# EAGLE design tlacitka (EAGLE 4.11)
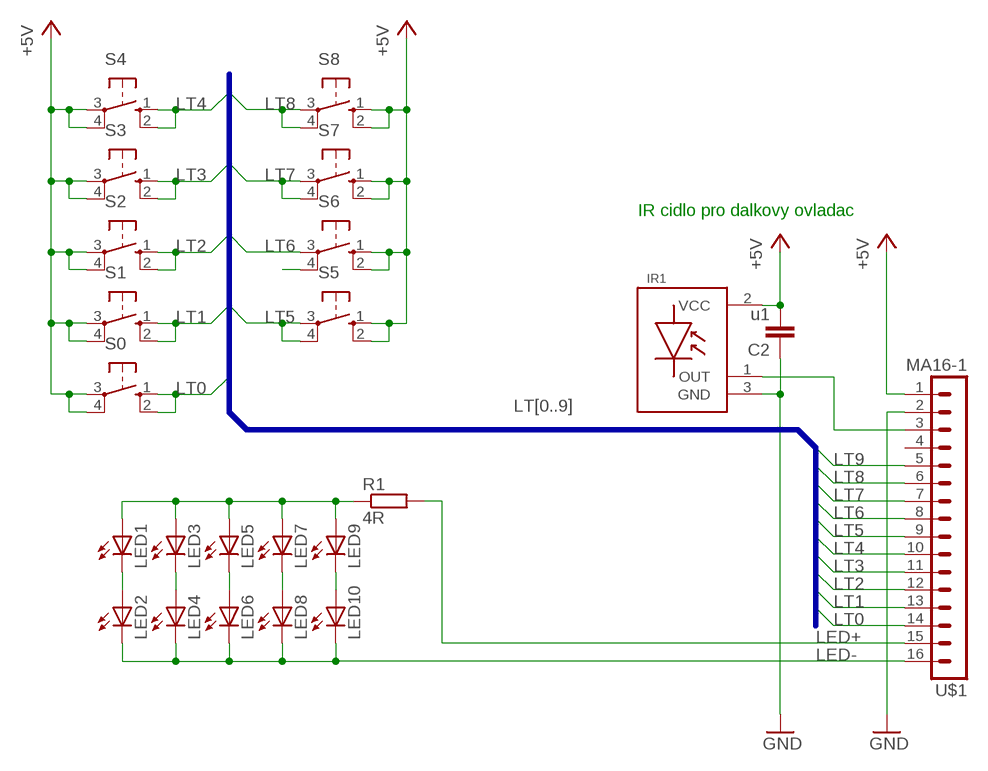
[diagram p0: schematic, sheet 1]

## Parts
C2  u1  C-EUC1206  [C1206]
IR1  SFH506-56  [SFH506]
LED1  LEDCHIPLED_1206  [CHIPLED_1206]
LED2  LEDCHIPLED_1206  [CHIPLED_1206]
LED3  LEDCHIPLED_1206  [CHIPLED_1206]
LED4  LEDCHIPLED_1206  [CHIPLED_1206]
LED5  LEDCHIPLED_1206  [CHIPLED_1206]
LED6  LEDCHIPLED_1206  [CHIPLED_1206]
LED7  LEDCHIPLED_1206  [CHIPLED_1206]
LED8  LEDCHIPLED_1206  [CHIPLED_1206]
LED9  LEDCHIPLED_1206  [CHIPLED_1206]
LED10  LEDCHIPLED_1206  [CHIPLED_1206]
R1  4R  R-EU_R1206  [R1206]
S0  10-XX  [B3F-10XX]
S1  10-XX  [B3F-10XX]
S2  10-XX  [B3F-10XX]
S3  10-XX  [B3F-10XX]
S4  10-XX  [B3F-10XX]
S5  10-XX  [B3F-10XX]
S6  10-XX  [B3F-10XX]
S7  10-XX  [B3F-10XX]
S8  10-XX  [B3F-10XX]
U$1  MA16-1  [MA16-1]

## Nets
+5V: C2.2 IR1.2(VCC) S0.3(P) S0.4(P1) S1.3(P) S1.4(P1) S2.3(P) S2.4(P1) S3.3(P) S3.4(P1) S4.3(P) S4.4(P1) S5.1(S) S5.2(S1) S6.1(S) S6.2(S1) S7.1(S) S7.2(S1) S8.1(S) S8.2(S1) U$1.1
GND: C2.1 IR1.3(GND) U$1.2
IR: IR1.1(OUT) U$1.3
LED+: R1.2 U$1.15
LED-: LED2.C LED4.C LED6.C LED8.C LED10.C U$1.16
LT0: S0.1(S) S0.2(S1) U$1.14
LT1: S1.1(S) S1.2(S1) U$1.13
LT2: S2.1(S) S2.2(S1) U$1.12
LT3: S3.1(S) S3.2(S1) U$1.11
LT4: S4.1(S) S4.2(S1) U$1.10
LT5: S5.3(P) S5.4(P1) U$1.9
LT6: S6.3(P) U$1.8
LT7: S7.3(P) S7.4(P1) U$1.7
LT8: S8.3(P) S8.4(P1) U$1.6
LT9: U$1.5
N$4: LED1.C LED2.A
N$6: LED3.C LED4.A
N$7: LED5.C LED6.A
N$8: LED7.C LED8.A
N$9: LED9.C LED10.A
N$10: LED1.A LED3.A LED5.A LED7.A LED9.A R1.1
N$11: S6.4(P1)
Unconnected: U$1.4

## Buses
LT[0..9]

## Notes on the sheet
- IR cidlo pro dalkovy ovladac

## Library data of the parts
C2 = rcl:C-EU: CAPACITOR, European symbol
IR1 = _OH:SFH506-56
LED1-LED10 = led:LED: LED OSRAM: - CHIPLED LG R971, LG N971, LY N971, LG Q971, LY Q971, LO R971, LY R971 LH N974, LH R974 LS Q976, LO Q976, LY Q976 LO Q996 - Hyper CHIPLED LW Q18S LB Q993, LB Q99A, LB R99A - SideLED LS A670, LO A670, LY A670, LG A670, LP A670 LB A673, LV A673, LT A673, LW A673 LH A674 LY A675 LS A676, LA A676, LO A676, LY A676, LW A676 LS A679, LY A679, LG A679 - Hyper Micro SIDELED® LS Y876, LA Y876, LO Y876, LY Y876 LT Y87S - SmartLED LW L88C, LW L88S LB L89C, LB L89S, LG L890 LS L89K, LO L89K, LY L89K LS L896, LA L896, LO L896, LY L896 - TOPLED LS T670, LO T670, LY T670, LG T670, LP T670 LSG T670, LSP T670, LSY T670, LOP T670, LYG T670 LG T671, LOG T671, LSG T671 LB T673, LV T673, LT T673, LW T673 LH T674 LS T676, LA T676, LO T676, LY T676, LB T676, LH T676, LSB T676, LW T676 LB T67C, LV T67C, LT T67C, LS T67K, LO T67K, LY T67K, LW E67C LS E67B, LA E67B, LO E67B, LY E67B, LB E67C, LV E67C, LT E67C LW T67C LS T679, LY T679, LG T679 LS T770, LO T770, LY T770, LG T770, LP T770 LB T773, LV T773, LT T773, LW T773 LH T774 LS E675, LA E675, LY E675, LS T675 LS T776, LA T776, LO T776, LY T776, LB T776 LHGB T686 LT T68C, LB T68C - Hyper Mini TOPLED® LB M676 - Mini TOPLED Santana® LG M470 LS M47K, LO M47K, LY M47K Source: http://www.osram.convergy.de/
R1 = rcl:R-EU_: RESISTOR, European symbol
S0 S1-S8 = switch-omron:10-XX: OMRON SWITCH
U$1 = con-lstb:MA16-1

## Board
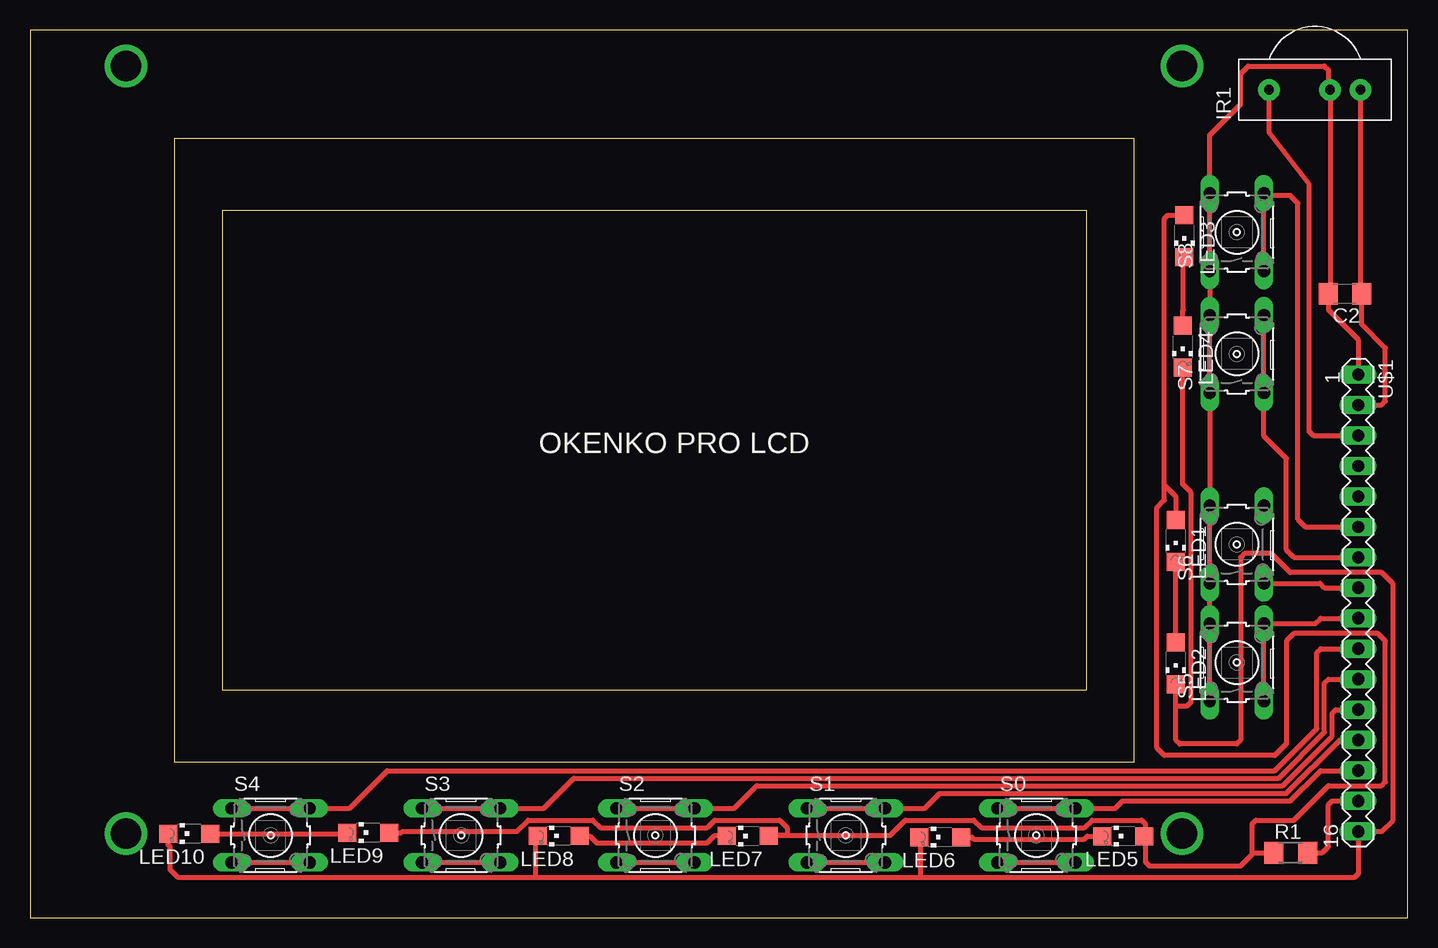
[diagram p1: board, top side]
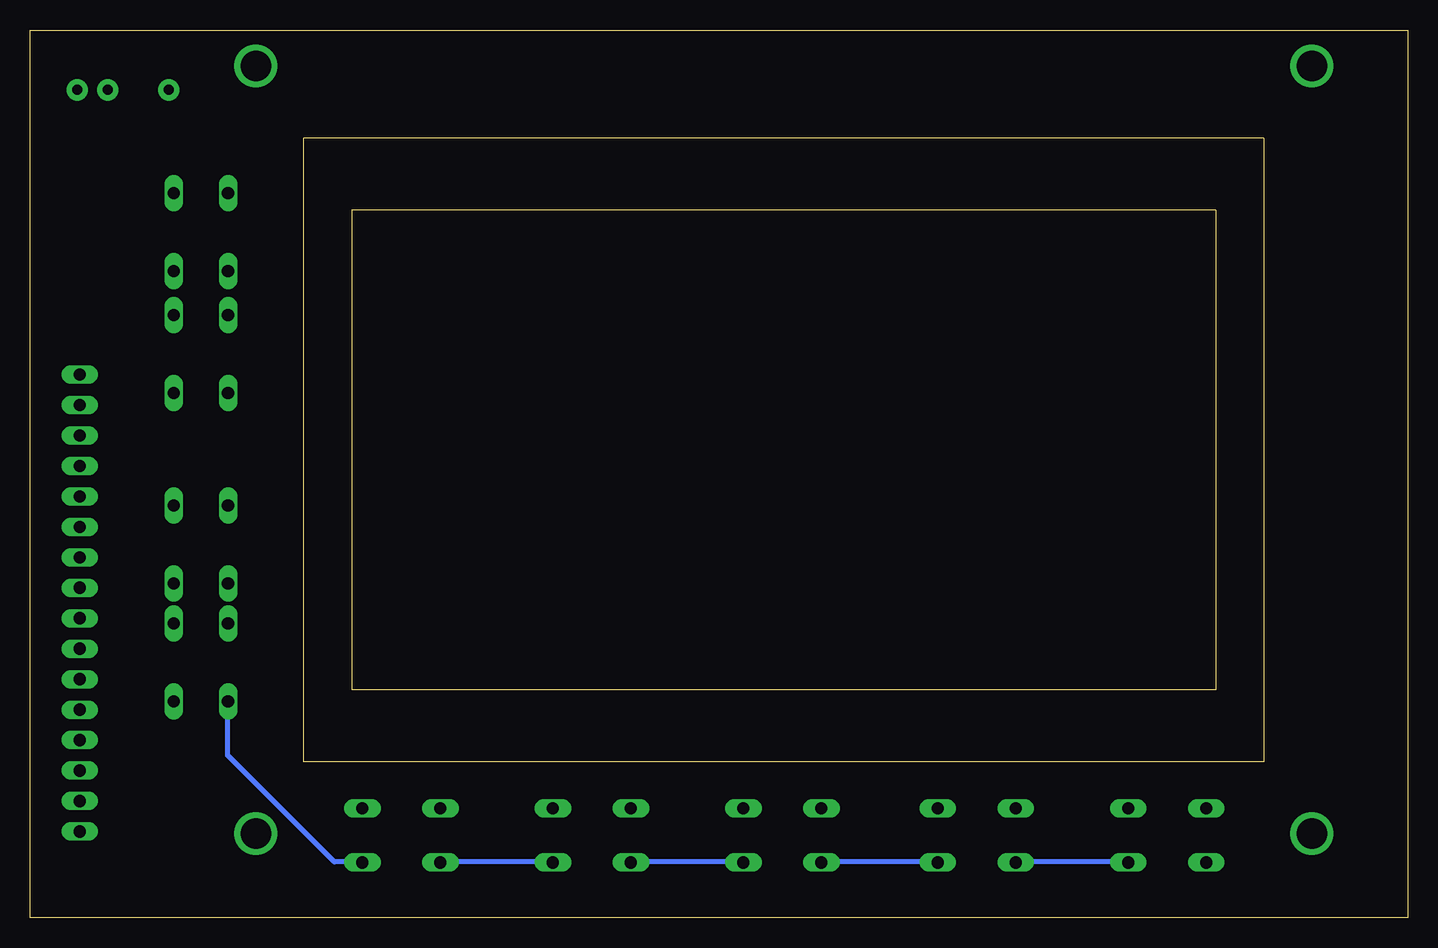
[diagram p2: board, bottom side, seen from below]

Size 114.82 x 74.01 mm. Coordinates in mm from the lower left corner, seen from the top.
Outline: 0,0 114.79,0 114.82,74.01 0.02,74.01 0,0
Outline: 12,65 12,13 92,13 92,65 12,65
Outline: 16,19 88,19 88,59 16,59 16,19
Copper layers (1*16): Top 0.035mm / dielectric 1.5mm / Bottom 0.035mm
Design rules "default": minimum track width 10mil, minimum drill 24mil, track to track 8mil, track to pad 8mil, pad to pad 8mil, via to via 8mil, smd to smd 8mil, copper to edge 40mil, drill to drill 8mil, minimum pad ring 10mil, minimum via ring 8mil, stop-mask expansion 4mil, vias tented up to drill 0mil, thermal gap 10mil

### Footprints (pad centres in the part's own frame; a part is rotated, then mirrored left to right if it is on the bottom)
C1206 = smd 1.6 x 1.8: 1 -1.4,0; 2 1.4,0
SFH506 = drill 0.813 pad 1.778 round: 1 0,7.62; 2 0,2.54; 3 0,0
CHIPLED_1206 = smd 1.5 x 1.5: A 0,-1.75; C 0,1.75
R1206 = smd 1.6 x 1.803: 1 -1.422,0; 2 1.422,0
B3F-10XX = drill 1.016 long: 1 -3.251,2.261; 2 3.251,2.261; 3 -3.251,-2.261; 4 3.251,-2.261
MA16-1 = drill 1.016 long: 1 -19.05,0; 2 -16.51,0; 3 -13.97,0; 4 -11.43,0; 5 -8.89,0; 6 -6.35,0; 7 -3.81,0; 8 -1.27,0; 9 1.27,0; 10 3.81,0; 11 6.35,0; 12 8.89,0; 13 11.43,0; 14 13.97,0; 15 16.51,0; 16 19.05,0

### Placement (x,y rotation side)
C2  109.58,51.99 180 top
IR1  110.88,69.02 90 top
LED1  95.48,31.4 180 top
LED2  95.48,21.2 180 top
LED3  96.2,56.8 180 top
LED4  96.06,47.6 180 top
LED5  91.09,6.8 90 top
LED6  75.85,6.71 90 top
LED7  59.8,6.8 90 top
LED8  44.06,6.81 90 top
LED9  28.18,7.09 90 top
LED10  13.26,7 90 top
R1  105.06,5.4 0 top
S0  83.87,6.86 0 top
S1  67.99,6.86 0 top
S2  52.12,6.86 0 top
S3  35.92,6.86 0 top
S4  20.05,6.86 0 top
S5  100.57,21.27 90 top
S6  100.57,31.11 90 top
S7  100.57,46.99 90 top
S8  100.57,57.15 90 top
U$1  110.68,26.23 270 top

### Tracks (layer width: path | path; a pad name or v marks a point on that pad's centre or on a via)
+5V  (via drill 0.3 pad 1.42)
  Top 0.406: 98.23,50.24 98.03,50.04 | 98.23,50.24 S7.2 98.31,43.72 | 98.23,50.24 98.35,50.36 98.35,53.85 98.31,53.88 | 98.31,43.72 S7.1 | 98.31,43.72 98.35,43.69 98.35,34.16 98.31,34.2 S6.2 S6.1 | S6.1 98.31,27.85 98.35,27.81 | S6.1 S5.2 98.31,18.01 | 23.37,4.59 S4.4 | S4.3 23.37,4.59 | 23.37,4.59 v23.42,4.64 | 32.62,4.64 S3.3 S3.4 39.25,4.59 v39.29,4.64 | 48.77,4.59 48.82,4.64 48.86,4.59 S2.3 S2.4 55.44,4.59 v55.48,4.64 | 64.65,4.59 64.69,4.64 S1.3 S1.4 71.32,4.59 v71.36,4.64 | 80.88,4.64 80.84,4.59 S0.3 S0.4 87.19,4.59 v87.23,4.64 | 108.19,51.63 108.18,51.64 C2.2 | 108.19,51.63 108.34,51.78 IR1.2 108.44,69.02 108.51,69.09 108.19,69.41 108.19,70.68 107.87,70.99 101.52,70.99 100.89,70.36 100.89,67.82 98.31,65.24 S8.2 98.31,53.88 | U$1.1 110.68,48.18 108.19,50.67 108.19,51.63 | 98.31,53.88 S8.1 | S5.1 98.31,18.01 | 98.31,18.01 98.35,17.97
  Bottom 0.406: S3.3 32.62,4.64 v23.42,4.64 | S2.3 48.86,4.59 48.82,4.64 v39.29,4.64 | S1.3 64.69,4.64 v55.48,4.64 | S0.3 80.61,4.59 80.57,4.64 v71.36,4.64 | v87.23,4.64 89.46,4.64 98.35,13.53 98.35,17.97 98.31,18.01 S5.1
GND
  Top 0.406: 110.99,51.99 111.05,51.94 | 110.99,51.99 C2.1 110.98,49.47 112.95,47.5 112.95,43.05 112.63,42.74 110.73,42.74 110.72,42.74 U$1.2 | IR1.3 110.88,52.11 110.99,51.99
IR
  Top 0.406: IR1.1 103.26,65.45 106.6,61.15 106.6,40.51 106.92,40.2 110.73,40.2 110.72,40.2 U$1.3
LED+
  Top 0.406: R1.2 107.68,5.4 108.19,5.91 108.19,9.4 108.51,9.72 110.73,9.72 110.72,9.72 U$1.15
LED-
  Top 0.406: LED10.C 11.51,6.07 11.67,5.91 11.67,4 12.3,3.37 42.15,3.37 | 42.15,6.54 42.15,6.86 42.19,6.81 LED8.C 42.31,6.7 42.15,6.54 | 42.15,3.37 42.15,6.54 | 42.15,3.37 74.22,3.37 | 74.22,6.22 74.22,6.54 74.1,6.65 LED6.C 74.1,6.34 74.22,6.22 | 74.22,3.37 74.22,6.22 | 74.22,3.37 110.41,3.37 110.73,3.68 110.73,7.18 110.72,7.18 U$1.16 110.41,7.18 112.63,7.18 113.59,8.13 113.59,27.81 112.63,28.77 105.01,28.77 103.43,30.35 101.2,30.35 100.89,30.04 100.89,14.8 100.57,14.48 95.81,14.48 95.49,14.8 95.49,17.65 | LED4.C 96.06,36.13 96.76,35.43 96.76,17.97 96.44,17.65 95.49,17.65 | LED2.C 95.48,19.25 95.49,19.24 95.49,17.65
LT0
  Top 0.406: S0.1 S0.2 | S0.2 87.2,9.12 87.23,9.08 | S0.2 90.44,9.12 91.04,9.72 105.01,9.72 107.55,12.26 110.73,12.26 110.72,12.26 U$1.14
LT1
  Top 0.406: S1.1 71.01,9.12 71.04,9.08 71.08,9.12 S1.2 74.57,9.12 75.8,10.35 104.7,10.35 109.14,14.8 110.73,14.8 110.72,14.8 U$1.13
LT2
  Top 0.406: S2.1 55.13,9.12 55.17,9.08 55.2,9.12 S2.2 58.69,9.12 60.56,10.99 104.38,10.99 108.51,15.11 108.51,17.02 108.82,17.34 111.05,17.34 111.04,17.34 U$1.12
LT3
  Top 0.406: S3.1 S3.2 | S3.2 39.26,9.12 39.29,9.08 | S3.2 42.82,9.12 45.32,11.62 104.06,11.62 107.87,15.43 107.87,19.56 108.19,19.88 110.73,19.88 110.72,19.88 U$1.11
LT4
  Top 0.406: S4.1 S4.2 | S4.2 23.38,9.12 23.42,9.08 | S4.2 26.63,9.12 29.77,12.26 103.74,12.26 107.24,15.75 107.24,22.1 107.55,22.42 110.41,22.42 U$1.10
LT5
  Top 0.406: U$1.9 110.41,24.96 107.55,24.96 107.12,24.52 S5.4 S5.3 | S5.3 | S5.3 102.79,17.97
LT6
  Top 0.406: S6.3 107.5,27.86 107.87,27.5 110.73,27.5 110.72,27.5 U$1.8
LT7
  Top 0.406: S7.3 102.79,43.69 | S7.3 S7.4 | S7.3 102.83,40.15 104.7,38.29 104.7,30.67 105.33,30.04 110.41,30.04 U$1.7
LT8
  Top 0.406: U$1.6 106.28,32.58 105.65,33.21 105.65,59.56 105.01,60.2 102.79,60.2 | 102.79,60.2 102.83,60.24 S8.4 | S8.3 102.79,53.85 102.79,60.2
N$1  (via drill 2.54)
  other vias: 8,71
N$2  (via drill 2.54)
  other vias: 8,7
N$3  (via drill 2.54)
  other vias: 96,7
N$4
  Top 0.406: LED1.C 95.48,29.41 95.49,29.4 95.48,29.39 LED2.A
N$5  (via drill 2.54)
  other vias: 96,71
N$6
  Top 0.406: LED4.A 96.06,50.61 96.12,50.67 96.12,54.8 96.2,54.88 LED3.C
N$7
  Top 0.406: LED6.A 78.49,6.71 78.66,6.54 87.87,6.54 88.12,6.8 LED5.C
N$8
  Top 0.406: LED8.A 46.64,6.81 47.23,6.22 56.44,6.22 57.07,6.86 58.02,6.86 58.05,6.84 LED7.C
N$9
  Top 0.406: LED9.C 26.43,7.02 26.27,6.86 26.13,7 LED10.A
N$10
  Top 0.406: LED9.A 30.95,7.09 31.04,7.18 40.56,7.18 41.51,8.13 46.91,8.13 47.55,7.49 56.44,7.49 57.07,8.13 62.47,8.13 63.1,7.49 63.1,6.86 61.83,6.86 | 61.83,6.86 61.52,6.86 61.55,6.83 LED7.A 61.78,6.8 61.83,6.86 | 61.83,6.86 71.68,6.86 72.95,8.13 78.66,8.13 79.3,7.49 87.87,7.49 88.5,8.13 92.63,8.13 92.95,7.81 92.95,6.86 | 92.95,6.86 92.89,6.8 LED5.A | 92.95,6.86 92.95,4.64 93.27,4.32 100.89,4.32 101.84,5.27 | R1.1 101.97,5.4 101.84,5.27 | 101.84,5.27 101.84,7.81 102.16,8.13 105.33,8.13 108.19,10.99 112.63,10.99 112.95,11.3 112.95,23.05 112.32,23.69 105.33,23.69 104.7,23.05 104.7,14.48 103.74,13.53 94.54,13.53 93.9,14.16 93.9,34.16 94.54,34.8 94.54,36.07 | LED3.A 94.8,58.55 94.54,58.29 94.54,36.07 | LED1.A 95.48,35.13 94.54,36.07

### Text on the board
tPlace: OKENKO PRO LCD